# Altium schematic sheet USB_ISOL.SchDoc: Isolated
size 420 x 297 mm; SPICEModelCacheMEOSHKXJ: <root> / <DocumentId>MEOSHKXJ</DocumentId> / <CacheFrame Number="0"> / <Model Name="pk14" Kind="CKT"> / <Text>*.INC dhvqfn.s / .SUBCKT pk14 / +    1   2   3   4   5   6   7   8   9  10 / +   11  12  13  14 / +   15  16  17  18  19  20  21  22  23  24 / +   25  26  27  28 / * Pin Resistance / r1 1 1001 9.078E-02 / r2 2 1002 8.829E-02 / r3 3 1003 8.731E-02 / r4 4 1004 8.710E-02 / r5 5 1005 8.731E-02 / r6 6 1006 8.829E-02 / r7 7 1007 9.075E-02 / r8 8 1008 9.072E-02 / r9 9 1009 8.809E-02 / r10 10 1010 8.716E-02 / r11 11 1011 8.706E-02 / r12 12 1012 8.720E-02 / r13 13 1013 8.816E-02 / r14 14 1014 9.068E-02 / * Pin Inductance / l1 1001 15 2.981E-09 / l2 1002 16 2.447E-09 / l3 1003 17 2.304E-09 / l4 1004 18 2.291E-09 / l5 1005 19 2.307E-09 / l6 1006 20 2.449E-09 / l7 1007 21 2.971E-09 / l8 1008 22 2.972E-09 / l9 1009 23 2.425E-09 / l10 1010 24 2.286E-09 / l11 1011 25 2.280E-09 / l12 1012 26 2.286E-09 / l13 1013 27 2.425E-09 / l14 1014 28 2.975E-09 / .ENDS pk14</Text> / </Model> / </CacheFrame> / </root>; Author: G.Kasprowicz; CompanyName: WUT ISE; DrawnBy: G.Kasprowicz; Organization: WUT ISE; Address1: PW ISE; Address2: Nowowiejska 15/19 00-665 Warsaw; Address3: gkasprow@gmail.com; Revision: 2; SheetNumber: -; SheetTotal: -; ModifiedBy: -; CheckedDate: -; Title2: USB to I2C interface; DivGrp: WUT ISE; Designer: G.Kasprowicz; ModifiedDate: -; ProjectName: Sensor Box
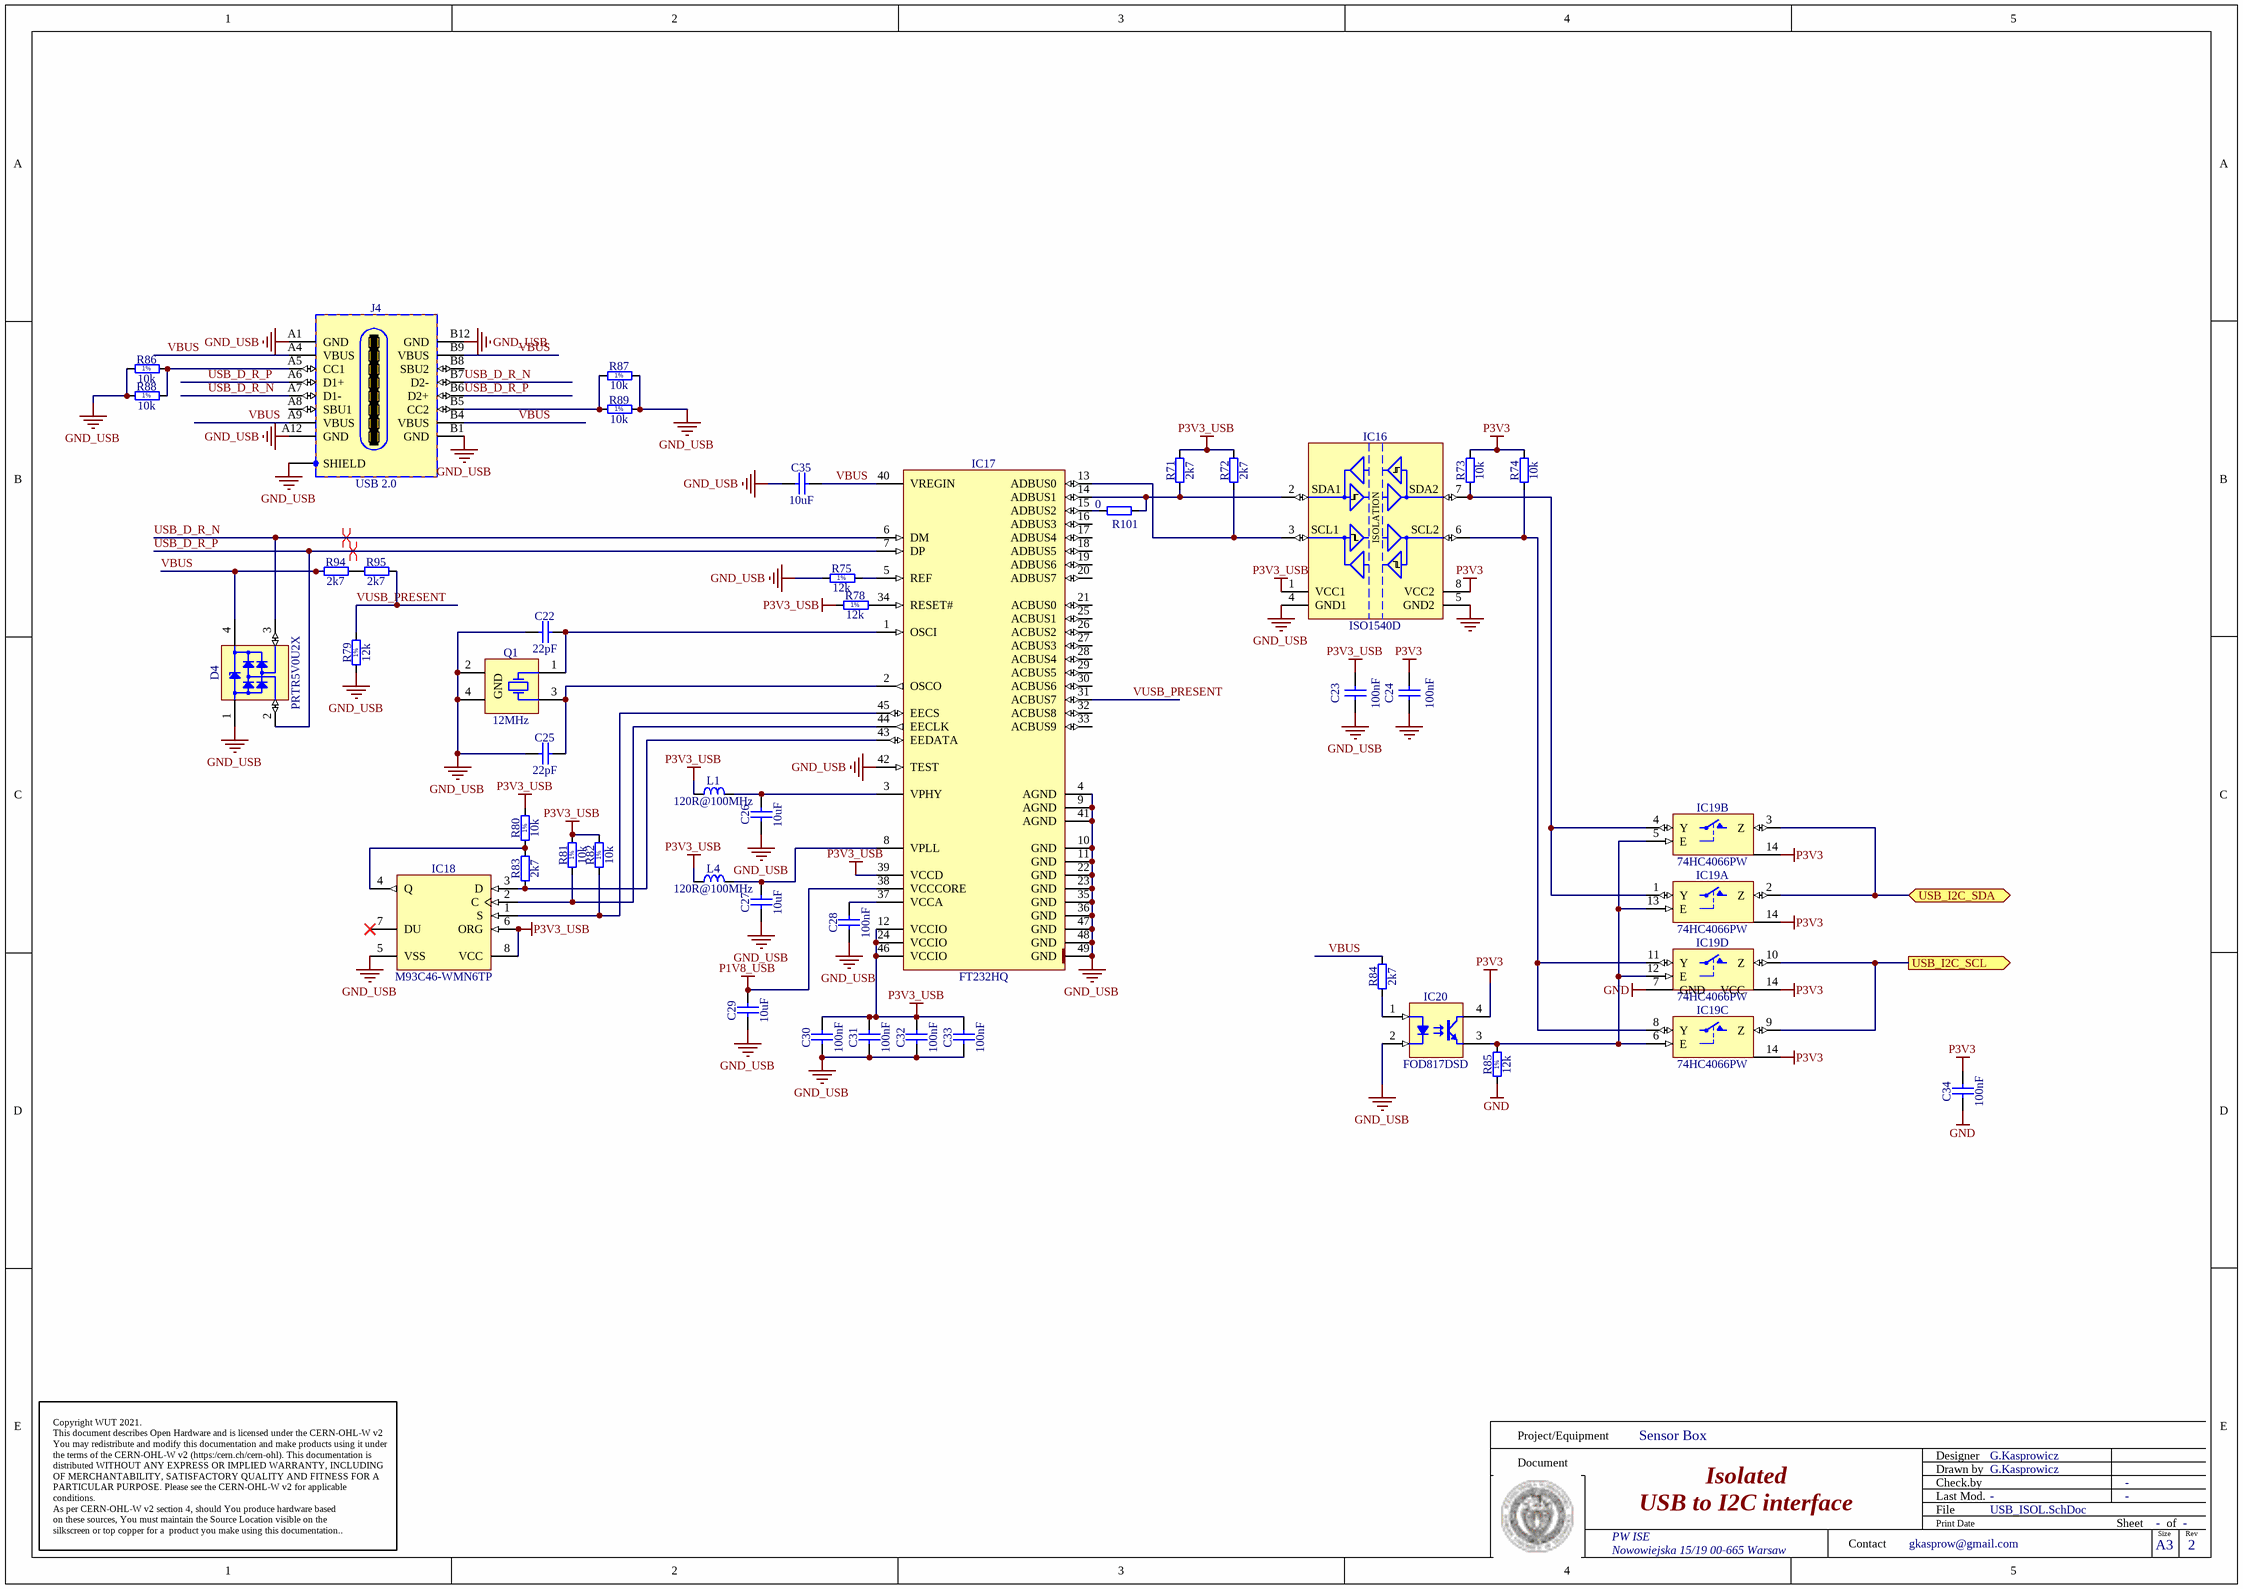
[diagram p0: USB_ISOL.SchDoc]

## Parts
C22  22pF  [CAPC1005X55N]
C23  100nF  [CAPC1005X55N]
C24  100nF  [CAPC1005X55N]
C25  22pF  [CAPC1005X55N]
C26  10uF  [CAPC2012X95N]
C27  10uF  [CAPC2012X95N]
C28  100nF  [CAPC1005X55N]
C29  10uF  [CAPC2012X95N]
C30  100nF  [CAPC1005X55N]
C31  100nF  [CAPC1005X55N]
C32  100nF  [CAPC1005X55N]
C33  100nF  [CAPC1005X55N]
C34  100nF  [CAPC1005X55N]
C35  10uF  [CAPC2012X95N]
D4  PRTR5V0U2X  [SOT190P230X110-4N]
IC16  ISO1540D  [SOIC127P600X175-8N]
IC17  FT232HQ  [QFN50P800X800X90-49N-S625]
IC18  M93C46-WMN6TP  [SOIC127P600X175-8N]
IC19  74HC4066PW  [SOP65P640X110-14N]  (parts A,B,C,D of 4)
IC20  FOD817DSD  [FAIRCHILD_FOD817DSD]
J4  USB 2.0  [GCT_USB4105-GF-A]
L1  120R@100MHz  [INDC1608X65N]
L4  120R@100MHz  [INDC1608X65N]
Q1  12MHz  [XTAL_TXC_7M]
R71  2k7  [RESC1608X55N]
R72  2k7  [RESC1608X55N]
R73  10k  [RESC1005X40N]
R74  10k  [RESC1005X40N]
R75  12k  [RESC1005X40N]
R78  12k  [RESC1005X40N]
R79  12k  [RESC1005X40N]
R80  10k  [RESC1005X40N]
R81  10k  [RESC1005X40N]
R82  10k  [RESC1005X40N]
R83  2k7  [RESC1608X55N]
R84  2k7  [RESC1608X55N]
R85  12k  [RESC1005X40N]
R86  10k  [RESC1005X40N]
R87  10k  [RESC1005X40N]
R88  10k  [RESC1005X40N]
R89  10k  [RESC1005X40N]
R94  2k7  [RESC1608X55N]
R95  2k7  [RESC1608X55N]
R101  0  [RESC1005X40N]

## Ports
USB_I2C_SCL (out), USB_I2C_SDA (bidir)

## Nets
GND: C24.1 C34.1 IC16.5(GND2) IC19.7(GND) R85.1
GND_USB: C22.1 C23.1 C25.1 C26.1 C27.1 C28.1 C29.1 C30.1 C31.1 C32.1 C33.1 C35.1 D4.1(GND) IC16.4(GND1) IC17.4(AGND) IC17.9(AGND) IC17.10(GND) IC17.11(GND) IC17.22(GND) IC17.23(GND) IC17.35(GND) IC17.36(GND) IC17.41(AGND) IC17.42(TEST) IC17.47(GND) IC17.48(GND) IC17.49(GND) IC18.5(VSS) IC20.2(C) J4.A1(GND) J4.A12(GND) J4.B1(GND) J4.B12(GND) J4.SHIELD Q1.2(GND) Q1.4(GND) R75.1 R79.1 R86.1 R87.2 R88.1 R89.2
P1V8_USB: C29.2 IC17.38(VCCCORE)
P3V3: C24.2 C34.2 IC16.8(VCC2) IC19.14(VCC) IC20.4(C) R73.2 R74.2
P3V3_USB: C23.2 C30.2 C31.2 C32.2 C33.2 IC16.1(VCC1) IC17.12(VCCIO) IC17.24(VCCIO) IC17.39(VCCD) IC17.46(VCCIO) IC18.6(ORG) IC18.8(VCC) L1.1 L4.1 R71.2 R72.2 R78.1 R80.2 R81.2 R82.2
USB_D_R_N: D4.3(I/O2) IC17.6(DM) J4.A7(D1-) J4.B7(D2-)
USB_D_R_P: D4.2(I/O1) IC17.7(DP) J4.A6(D1+) J4.B6(D2+)
USB_I2C_SCL: IC19.9(Z) IC19.10(Z) ; port USB_I2C_SCL
USB_I2C_SDA: IC19.2(Z) IC19.3(Z) ; port USB_I2C_SDA
VBUS: C35.2 D4.4(VCC) IC17.40(VREGIN) J4.A4(VBUS) J4.A9(VBUS) J4.B4(VBUS) J4.B9(VBUS) R84.1 R94.1
VUSB_PRESENT: IC17.31(ACBUS7) R79.2 R95.2
NetC22_2: C22.2 IC17.1(OSCI) Q1.1(X)
NetC25_2: C25.2 IC17.2(OSCO) Q1.3(X)
NetC26_2: C26.2 IC17.3(VPHY) L1.2
NetC27_2: C27.2 IC17.8(VPLL) L4.2
NetC28_2: C28.2 IC17.37(VCCA)
NetIC16_2: IC16.2(SDA1) IC17.14(ADBUS1) R71.1 R101.2
NetIC16_3: IC16.3(SCL1) IC17.13(ADBUS0) R72.1
NetIC16_6: IC16.6(SCL2) IC19.8(Y) IC19.11(Y) R74.1
NetIC16_7: IC16.7(SDA2) IC19.1(Y) IC19.4(Y) R73.1
NetIC17_5: IC17.5(REF) R75.2
NetIC17_15: IC17.15(ADBUS2) R101.1
NetIC17_34: IC17.34(RESET#) R78.2
NetIC17_43: IC17.43(EEDATA) IC18.3(D) R83.2
NetIC17_44: IC17.44(EECLK) IC18.2(C) R81.1
NetIC17_45: IC17.45(EECS) IC18.1(S) R82.1
NetIC18_4: IC18.4(Q) R80.1 R83.1
NetIC19_5: IC19.5(E) IC19.6(E) IC19.12(E) IC19.13(E) IC20.3(E) R85.2
NetIC20_1: IC20.1(A) R84.2
NetJ4_A5: J4.A5(CC1) R86.2 R88.2
NetJ4_B5: J4.B5(CC2) R87.1 R89.1
NetR94_2: R94.2 R95.1

Not connected (* = marked no-connect by the designer): IC17 16(ADBUS3) 17(ADBUS4) 18(ADBUS5) 19(ADBUS6) 20(ADBUS7) 21(ACBUS0) 25(ACBUS1) 26(ACBUS2) 27(ACBUS3) 28(ACBUS4) 29(ACBUS5) 30(ACBUS6) 32(ACBUS8) 33(ACBUS9); IC18 7(DU)*; J4 A8(SBU1) B8(SBU2)

## Layout directives
differential pair; differential pair class Diff_90Ohm: USB_D_R_N, USB_D_R_P

## Notes on the sheet
- Project/Equipment
- Document
- Designer
- Drawn by
- Check.by
- Contact
- File
- Last Mod.
- Print Date
- Sheet
- Size
- A3
- of
- Rev
- Copyright WUT 2021.
  This document describes Open Hardware and is licensed under the CERN-OHL-W v2
  You may redistribute and modify this documentation and make products using it under the terms of the CERN-OHL-W v2 (https:/cern.ch/cern-ohl). This documentation is distributed WITHOUT ANY EXPRESS OR IMPLIED WARRANTY, INCLUDING OF MERCHANTABILITY, SATISFACTORY QUALITY AND FITNESS FOR A PARTICULAR PURPOSE. Please see the CERN-OHL-W v2 for applicable conditions.
  As per CERN-OHL-W v2 section 4, should You produce hardware based
  on these sources, You must maintain the Source Location visible on the
  silkscreen or top copper for a  product you make using this documentation..
- (in symbol ISO1540D) ISOLATION
- (in symbol R0402_10K_1%_0.0625W_100PPM) 1%
- (in symbol R0402_12K_1%_0.0625W_100PPM) 1%

## Library data of the parts
C22 C25 = CC0402_22PF_50V_5%_C0G: Non-polarised capacitor; Part Description: SMD Multilayer Chip Ceramic Capacitor; Manufacturer: GENERIC; Manufacturer1 Part Number: C0402C220J5GACTU; Voltage: 50V; TC: C0G/NP0; Tolerance: ±5%; Part Number: CC0402_22PF_50V_5%_C0G; Component Kind: Standard; Component Type: Standard; Pin Count: 2; Value: 22pF; Status: Preferred; Manufacturer Part Number: CC0402_22PF_50V_5%_C0G; Case: 0402; Mounted: Yes; Socket: No; SMD: Yes; Sense: No; Manufacturer1 Example: KEMET; Manufacturer1 ComponentHeight: 0.55mm; HelpURL: \\cern.ch\dfs\Applications\Altium\Datasheets\CC0805_C0G_KEMET_(Commercial Grade).pdf; Author: CERN DEM JLC; CreateDate: 03.12.2007; LatestRevisionDate: 03.12.2007
C23 C24 C28 C30-C34 = CC0402_100NF_50V_10%_X7R: Non-polarised capacitor; Part Description: SMD Multilayer Chip Ceramic Capacitor; Manufacturer: GENERIC; Manufacturer1 Part Number: GRM155R71H104KE14D; Voltage: 50V; TC: X7R; Tolerance: ±10%; Part Number: CC0402_100NF_50V_10%_X7R; Component Kind: Standard; Component Type: Standard; Pin Count: 2; Value: 100nF; Status: None; Manufacturer Part Number: CC0402_100NF_50V_10%_X7R; Case: 0402; Mounted: Yes; Socket: No; SMD: Yes; Sense: No; Manufacturer1 Example: MURATA; Manufacturer1 ComponentHeight: 0.55mm; HelpURL: \\cern.ch\dfs\Applications\Altium\Datasheets\CC0402_MURATA_GRM155R71H104KE14D.pdf; Author: CERN DEM MR; CreateDate: 30.06.2017; LatestRevisionDate: 30.06.2017
C26 C27 C29 C35 = CC0805_10UF_25V_10%_X5R: Non-polarised capacitor; Part Description: SMD Multilayer Chip Ceramic Capacitor; Manufacturer: GENERIC; Manufacturer1 Part Number: GRM219R61E106KA12D; Voltage: 25V; TC: X5R; Tolerance: ±10%; Part Number: CC0805_10UF_25V_10%_X5R; Component Kind: Standard; Component Type: Standard; Pin Count: 2; Value: 10uF; Status: Preferred; Manufacturer Part Number: CC0805_10UF_25V_10%_X5R; Case: 0805; Mounted: Yes; Socket: No; SMD: Yes; Sense: No; Manufacturer1 Example: MURATA; Manufacturer1 ComponentHeight: 0.95mm; HelpURL: \\cern.ch\dfs\Applications\Altium\Datasheets\CC0805_X5R_MURATA_GRM.pdf; Author: CERN DEM JLC; CreateDate: 25.10.2012; LatestRevisionDate: 06.09.2016
D4 = PRTR5V0U2X: Ultra Low Capacitance Double Rail-to-Rail ESD Protection Diode; Part Description: Ultra Low Capacitance (1pF) Double Rail-to-Rail ESD Protection Diode (8kV); Manufacturer: NXP SEMICONDUCTORS; Voltage: 5.5V; PressFit: No; Bonding: No; Part Number: PRTR5V0U2X; Component Kind: Standard; Component Type: Standard; Device: PRTR5V0U2X; PackageDescription: SOT143B, SOT, 1.90mm Pitch; 4 Pin, 1.30mm W X 2.90mm L X 1.10mm H body, IPC Medium Density; Manufacturer Part Number: PRTR5V0U2X; Pin Count: 4; Case: SOT143B; Mounted: Yes; Socket: No; SMD: Yes; Sense: No; ComponentHeight: 1.1mm; HelpURL: \\cern.ch\dfs\Applications\Altium\Datasheets\PRTR5V0U2X.pdf; Author: CERN DEM JLC; CreateDate: 22.03.2011; LatestRevisionDate: 22.03.2011
IC16 = ISO1540D: Low-Power Bi-Directional I2C Isolator; Manufacturer: TEXAS INSTRUMENTS; PressFit: No; Bonding: No; Part Number: ISO1540D; Component Kind: Standard; Component Type: Standard; Device: ISO1540D; PackageDescription: SOIC 8, Pitch 1.27mm - Body 4x5mm, IPC Medium Density; Part Description: Low-Power Bi-Directional I2C Isolator; Manufacturer Part Number: ISO1540D; Pin Count: 8; Case: SOIC8; Mounted: Yes; Socket: No; SMD: Yes; Sense: No; ComponentHeight: 1.75mm; Author: CERN DEM JLC; HelpURL: \\cern.ch\dfs\Applications\Altium\Datasheets\ISO1540D.pdf; CreateDate: 21.11.2013; LatestRevisionDate: 21.11.2013
IC17 = FT232HQ: Single channel High Speed USB To Multipurpose UART/FIFO IC; Manufacturer: FUTURE TECHNOLOGY DEVICES INTERNATIONAL (FTDI); PressFit: No; Bonding: No; Part Number: FT232HQ; Component Kind: Standard; Component Type: Standard; Device: FT232HQ; PackageDescription: QFN, 0.50mm Pitch, Square; 48 Pin, 8.00mm L X 8.00mm W X 0.90mm H body (w/Thermal Tab 6.25 X 6.25mm), IPC Medium Density; Part Description: Single Channel High Speed USB To Multipurpose UART/FIFO IC; Manufacturer Part Number: FT232HQ; Pin Count: 49; Case: QFN48; Mounted: Yes; Socket: No; SMD: Yes; Sense: No; ComponentHeight: 0.9mm; Author: CERN DEM BC; HelpURL: \\cern.ch\dfs\Applications\Altium\Datasheets\FT232HQ.pdf; CreateDate: 20.01.2021; LatestRevisionDate: 20.01.2021
IC18 = M93C46-WMN6TP: 2.5 to 5.5 V, 1Kb (128x8) Serial Microwire Bus EEPROM; Part Description: 1Kbit (128 x 8 bit or 64 x 16 bit) MICROWIRE® Serial Access EEPROM; Manufacturer: ST MICROELECTRONICS; PressFit: No; Bonding: No; Part Number: M93C46-WMN6TP; Component Kind: Standard; Component Type: Standard; Device: M93C46-WMN6TP; PackageDescription: SOIC 8, Pitch 1.27mm - Body 4x5mm, IPC Medium Density; Manufacturer Part Number: M93C46-WMN6TP; Pin Count: 8; Case: SOIC8; Mounted: Yes; Socket: No; SMD: Yes; Sense: No; ComponentHeight: 1.75mm; HelpURL: \\cern.ch\dfs\Applications\Altium\Datasheets\M93C46-WMN6TP.pdf; Author: CERN DEM JLC; CreateDate: 15.11.2012; LatestRevisionDate: 15.11.2012
IC19 = 74HC4066PW: Part Description: Quad Single-Pole Single-Throw Analog Switch; Manufacturer: NXP SEMICONDUCTORS; PressFit: No; Bonding: No; Table: Standard Logic; Part Number: 74HC4066PW; Component Kind: Standard; Component Type: Standard; Device: 74HC4066PW; PackageDescription: SOP, 14-Leads, Body 4.4x5mm (max), Pitch 0.65mm, IPC Medium Density; Manufacturer Part Number: 74HC4066PW; Pin Count: 14; Case: TSSOP14; Mounted: Yes; Socket: No; SMD: Yes; ComponentHeight: 1.1mm; Author: CERN DEM JLC; HelpURL: \\cern.ch\dfs\Applications\Altium\Datasheets\74HC4066PW.pdf; CreateDate: 2014-11-19; LatestRevisionDate: 2014-11-19
IC20 = FOD817DSD: Single Optocoupler; Part Description: 4-Pin High Operating Temperature Phototransistor Optocoupler; Manufacturer: FAIRCHILD SEMICONDUCTOR; PressFit: No; Bonding: No; Part Number: FOD817DSD; Component Kind: Standard; Component Type: Standard; Device: FOD817DSD; PackageDescription: SOIC, 2.54mm Pitch; 4 Pin, 6.50mm W X 4.60mm L X 4.60mm H body; Manufacturer Part Number: FOD817DSD; Pin Count: 4; Case: SOIC4; Mounted: Yes; Socket: No; SMD: Yes; Sense: No; ComponentHeight: 4.6mm; HelpURL: \\cern.ch\dfs\Applications\Altium\Datasheets\FOD817DSD.pdf; Author: CERN DEM JLC; CreateDate: 21.07.2014; LatestRevisionDate: 21.07.2014
J4 = GCT_USB4105-GF-A: 2x8 Pin + 1 Shield  USB Type C Receptacle; Part Description: USB 2.0 Type C Receptacle 16 Contacts, SMD, horizontal; Manufacturer: GCT; PressFit: No; Part Number: GCT_USB4105-GF-A; Component Kind: Standard; Component Type: Standard; Pin Count: 20; Family: USB 2.0; Mounted: Yes; Socket: No; SMD: Yes; Sense: No; Status: None; Manufacturer Part Number: USB4105-GF-A; ComponentHeight: 3.31mm; HelpURL: \\cern.ch\dfs\Applications\Altium\Datasheets\GCT_USB4105-GF-A.pdf; Author: CERN DEM HF; CreateDate: 12.10.2023; LatestRevisionDate: 12.10.2023
L1 L4 = IND0603_MURATA_BLM18SG121TN1D: Inductor; Part Description: SMD EMIFIL Suppression Chip Ferrite Bead; Manufacturer: MURATA; Power: 3A; Resistance: 0.025R; Tolerance: ±25%; Part Number: IND0603_MURATA_BLM18SG121TN1D; Component Kind: Standard; Component Type: Standard; Pin Count: 2; Value: 120R@100MHz; Status: None; Manufacturer Part Number: BLM18SG121TN1D; Case: 0603; Mounted: Yes; Socket: No; SMD: Yes; Sense: No; ComponentHeight: 0.65mm; HelpURL: \\cern.ch\dfs\Applications\Altium\Datasheets\IND0603_MURATA_BLM18S.pdf; Author: CERN DEM JLC; CreateDate: 23.07.2014; LatestRevisionDate: 23.07.2014
Q1 = XTAL_12MHZ_TXC_7M-12.000MAAJ-T: Crystal 4 pins 1=XTAL Control 2=GND3=XTAL 4=GND; Part Description: ±30ppm 18pF -20°C to +70°C  4 Pins, 3.2x2.5X0.8mm, SMD Sealing Crystal, 7M Series; Manufacturer: TXC CORPORATION; PressFit: No; Bonding: No; Part Number: XTAL_12MHZ_TXC_7M-12.000MAAJ-T; Component Kind: Standard; Component Type: Standard; PackageDescription: 4 Pins, 2.5x3.2mm, SMD Sealing Crystal, 7M Serie; Value: 12MHz; Manufacturer Part Number: 7M-12.000MAAJ-T; Pin Count: 4; Mounted: Yes; Socket: No; SMD: Yes; Sense: No; ComponentHeight: 0.8mm; HelpURL: \\cern.ch\dfs\Applications\Altium\Datasheets\XTAL_TXC_7M.pdf; Author: CERN DEM JLC; CreateDate: 19.06.2012; LatestRevisionDate: 19.06.2012
R71 R72 R83 R84 R94 R95 = R0603_2K7_1%_0.1W_100PPM: Resistor - 1%; Part Description: General Purpose Thick Film Chip Resistor; Manufacturer: GENERIC; Manufacturer1 Part Number: RC0603FR-072K7L; Power: 0.1W; TC: ±100ppm/°C; PressFit: No; Part Number: R0603_2K7_1%_0.1W_100PPM; Component Kind: Standard; Component Type: Standard; Pin Count: 2; Value: 2k7; Status: Preferred; Tolerance: ±1%; Manufacturer Part Number: R0603_2K7_1%_0.1W_100PPM; Case: 0603; Mounted: Yes; Sense: No; Socket: No; SMD: Yes; Manufacturer1 Example: YAGEO PHYCOMP; Manufacturer1 ComponentHeight: 0.55mm; HelpURL: \\cern.ch\dfs\Applications\Altium\Datasheets\R0603_PHYCOMP_RC0603.pdf; Author: CERN DEM JLC; CreateDate: 02.05.2011; LatestRevisionDate: 02.05.2011
R73 R74 R80-R82 R86-R89 = R0402_10K_1%_0.0625W_100PPM: Resistor - 1%; Part Description: General Purpose Thick Film Chip Resistor; Manufacturer: GENERIC; Manufacturer1 Part Number: 232270671003L; TC: ±100ppm/°C; PressFit: No; Part Number: R0402_10K_1%_0.0625W_100PPM; Component Kind: Standard; Component Type: Standard; Pin Count: 2; Value: 10k; Status: Not Recommended; Power: 0.0625W; Tolerance: ±1%; Manufacturer Part Number: R0402_10K_1%_0.0625W_100PPM; Case: 0402; Mounted: Yes; Sense: No; Socket: No; SMD: Yes; Manufacturer1 Example: YAGEO PHYCOMP; Manufacturer1 ComponentHeight: 0.4mm; HelpURL: \\cern.ch\dfs\Applications\Altium\Datasheets\R0402_Phycomp_RC0402.pdf; Author: CERN DEM JLC; CreateDate: 03.12.2007; LatestRevisionDate: 17.10.2012
R75 R78 R79 R85 = R0402_12K_1%_0.0625W_100PPM: Resistor - 1%; Part Description: General Purpose Thick Film Chip Resistor; Manufacturer: GENERIC; Manufacturer1 Part Number: 232270671203L; TC: ±100ppm/°C; PressFit: No; Part Number: R0402_12K_1%_0.0625W_100PPM; Component Kind: Standard; Component Type: Standard; Pin Count: 2; Value: 12k; Status: Not Recommended; Power: 0.0625W; Tolerance: ±1%; Manufacturer Part Number: R0402_12K_1%_0.0625W_100PPM; Case: 0402; Mounted: Yes; Sense: No; Socket: No; SMD: Yes; Manufacturer1 Example: YAGEO PHYCOMP; Manufacturer1 ComponentHeight: 0.4mm; HelpURL: \\cern.ch\dfs\Applications\Altium\Datasheets\R0402_Phycomp_RC0402.pdf; Author: CERN DEM JLC; CreateDate: 03.12.2007; LatestRevisionDate: 17.10.2012
R101 = R0402_0R_JUMPER: Resistor; Part Description: 1A (0.05R Max DC Resistance) Zero Ohm Jumper; Manufacturer: GENERIC; Manufacturer1 Part Number: 232270591001L; Part Number: R0402_0R_JUMPER; Component Kind: Standard; Component Type: Standard; Pin Count: 2; Value: 0; Status: Not recommended; Manufacturer Part Number: R0402_0R_JUMPER; Case: 0402; Mounted: Yes; Sense: No; Socket: No; SMD: Yes; Manufacturer1 Example: YAGEO PHYCOMP; Manufacturer1 ComponentHeight: 0.4mm; HelpURL: \\cern.ch\dfs\Applications\Altium\Datasheets\R0402_Phycomp_RC0402.pdf; Author: CERN DEM JLC; CreateDate: 03.12.2007; LatestRevisionDate: 17.10.2012